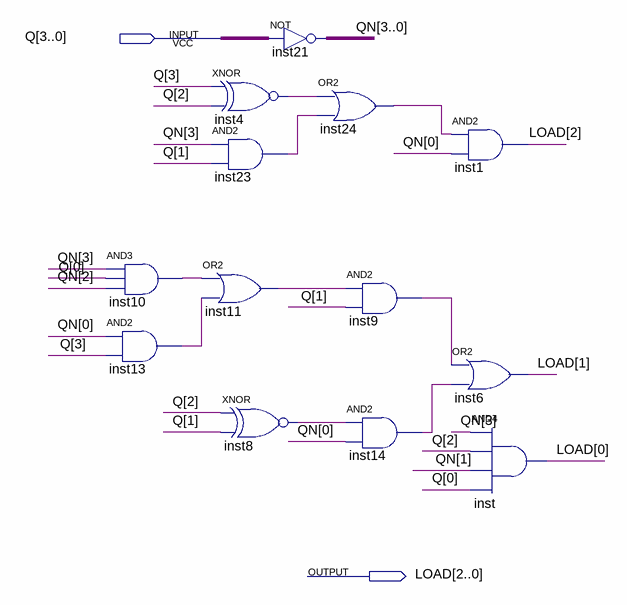
[diagram p0: schematic sheet]
// Quartus schematic laod.bdf as structural Verilog: 13 symbols, 2 pins
module laod (
  input  [3:0] Q,
  output [2:0] LOAD
);

  wire inst4_out, inst8_out, inst9_out, inst10_out, inst11_out, inst13_out, inst14_out, inst23_out,
       inst24_out;
  wire [3:0] QN;

  and inst10 (inst10_out, QN[3], Q[0], QN[2]);
  and inst13 (inst13_out, QN[0], Q[3]);
  or inst11 (inst11_out, inst10_out, inst13_out);
  assign QN = ~Q;  // NOT inst21, 4 bits wide
  xnor inst4 (inst4_out, Q[3], Q[2]);
  and inst23 (inst23_out, QN[3], Q[1]);
  xnor inst8 (inst8_out, Q[2], Q[1]);
  or inst24 (inst24_out, inst4_out, inst23_out);
  and inst9 (inst9_out, inst11_out, Q[1]);
  and inst14 (inst14_out, inst8_out, QN[0]);
  and inst1 (LOAD[2], inst24_out, QN[0]);
  or inst6 (LOAD[1], inst9_out, inst14_out);
  and inst (LOAD[0], QN[3], Q[2], QN[1], Q[0]);
endmodule
